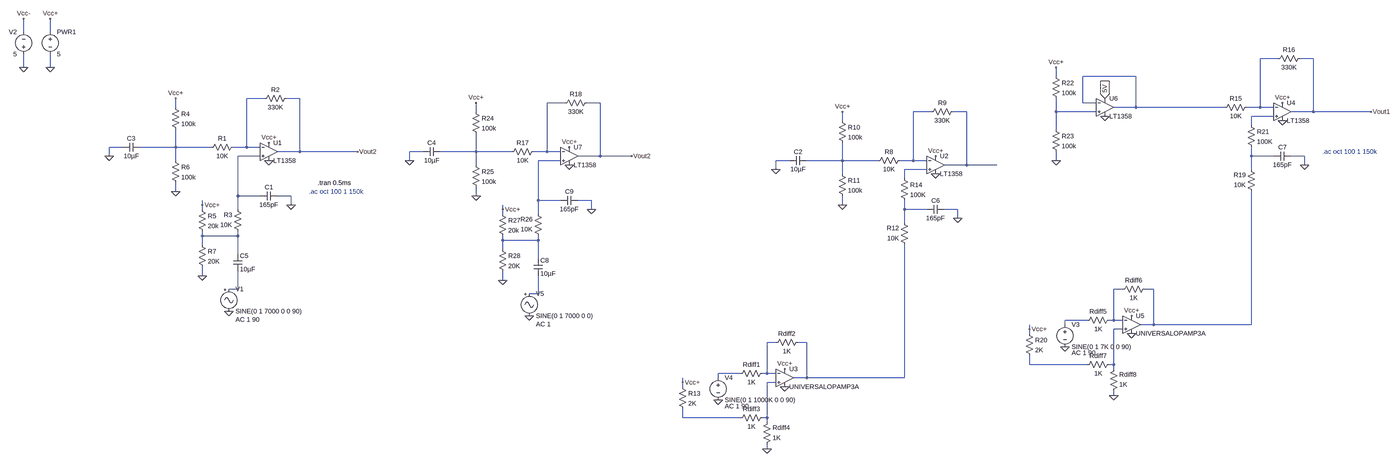
[diagram p0: schematic karens_new_amplifer_corrent_filtering_TESTTESTETESTSETE.asc, whole sheet]
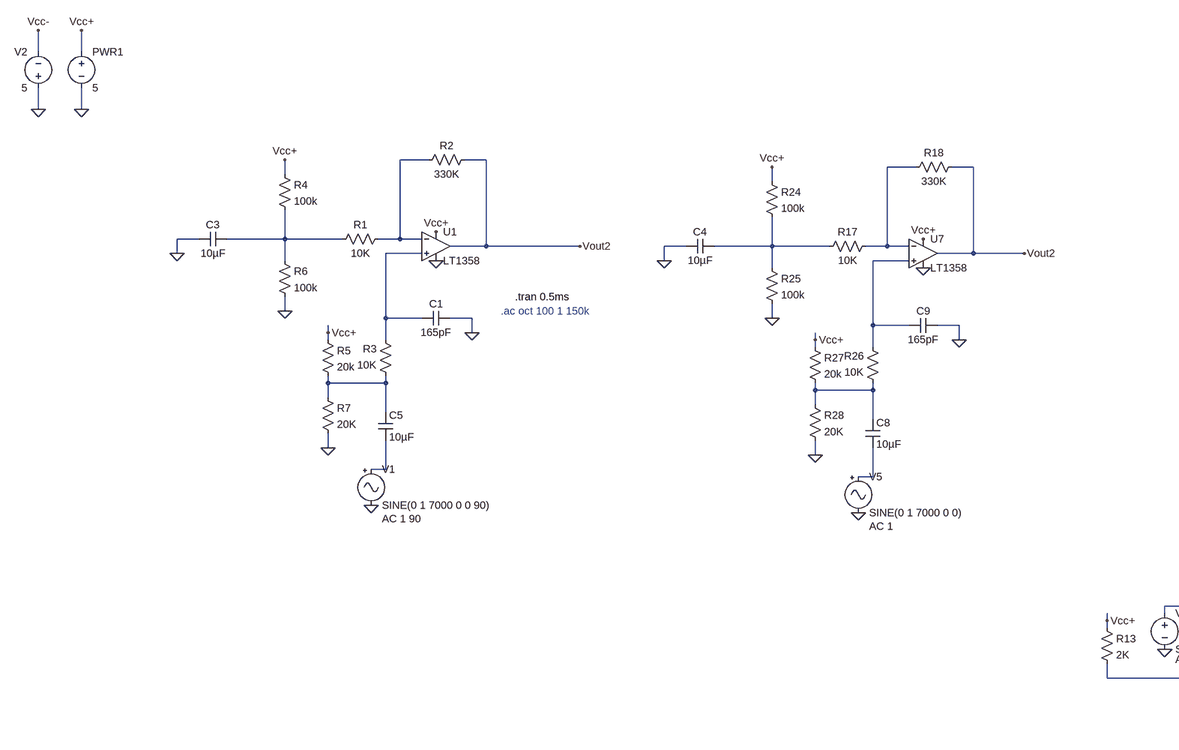
[diagram p1: schematic karens_new_amplifer_corrent_filtering_TESTTESTETESTSETE.asc, part, row 1 of 1, column 1 of 2]
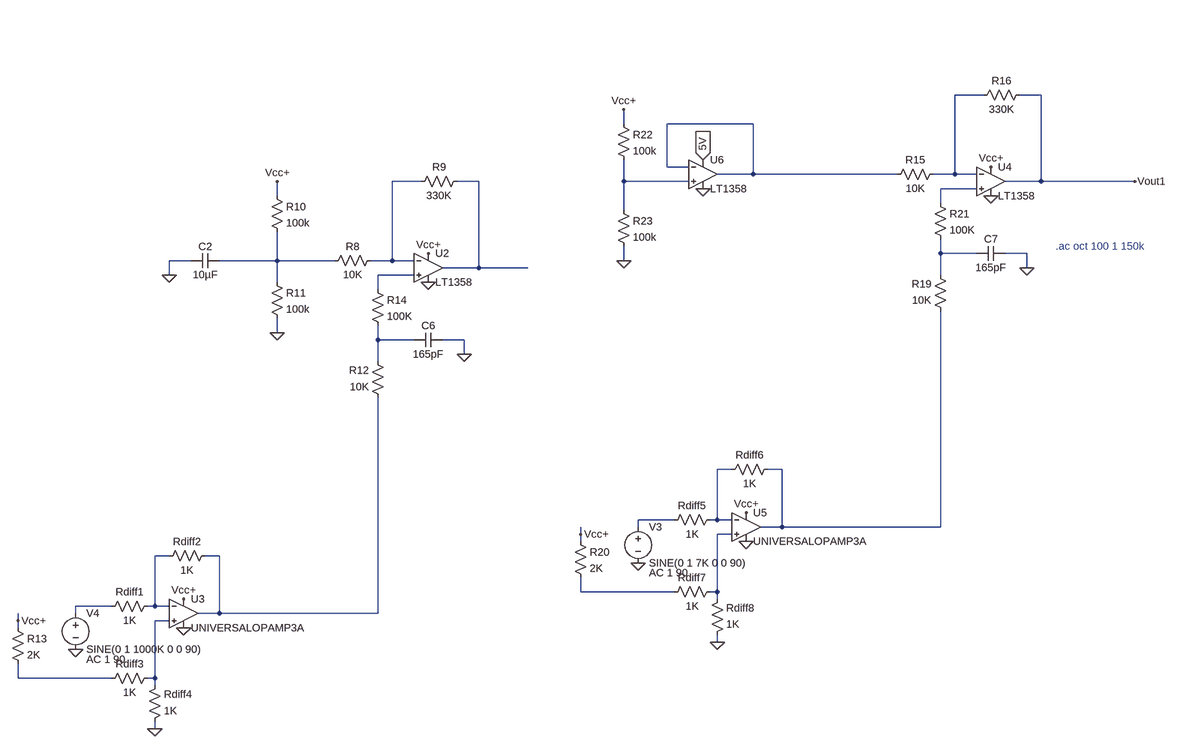
[diagram p2: schematic karens_new_amplifer_corrent_filtering_TESTTESTETESTSETE.asc, part, row 1 of 1, column 2 of 2]
karens_new_amplifer_corrent_filtering_TESTTESTETESTSETE.asc, the LTspice schematic file:
Version 4
SHEET 1 7728 1648
WIRE 32 -112 32 -160
WIRE 128 -112 128 -160
WIRE 7312 -16 7248 -16
WIRE 7440 -16 7392 -16
WIRE 32 16 32 -32
WIRE 128 16 128 -32
WIRE 6512 48 6512 16
WIRE 6800 48 6608 48
WIRE 1712 128 1648 128
WIRE 1840 128 1792 128
WIRE 2912 144 2848 144
WIRE 3040 144 2992 144
WIRE 6608 144 6608 48
WIRE 6656 144 6608 144
WIRE 1392 160 1392 128
WIRE 6800 160 6800 48
WIRE 6800 160 6720 160
WIRE 7120 160 6800 160
WIRE 7248 160 7248 -16
WIRE 7248 160 7200 160
WIRE 7296 160 7248 160
WIRE 2592 176 2592 144
WIRE 5088 176 5024 176
WIRE 5216 176 5168 176
WIRE 6512 176 6512 128
WIRE 6656 176 6512 176
WIRE 7440 176 7440 -16
WIRE 7440 176 7360 176
WIRE 7648 176 7440 176
WIRE 7296 192 7216 192
WIRE 4768 208 4768 176
WIRE 7216 224 7216 192
WIRE 6512 240 6512 176
WIRE 1200 304 1152 304
WIRE 1392 304 1392 240
WIRE 1392 304 1264 304
WIRE 1520 304 1392 304
WIRE 1648 304 1648 128
WIRE 1648 304 1600 304
WIRE 1696 304 1648 304
WIRE 1840 320 1840 128
WIRE 1840 320 1760 320
WIRE 2048 320 1840 320
WIRE 2400 320 2352 320
WIRE 2592 320 2592 256
WIRE 2592 320 2464 320
WIRE 2720 320 2592 320
WIRE 2848 320 2848 144
WIRE 2848 320 2800 320
WIRE 2896 320 2848 320
WIRE 1152 336 1152 304
WIRE 1696 336 1616 336
WIRE 3040 336 3040 144
WIRE 3040 336 2960 336
WIRE 3248 336 3040 336
WIRE 7216 336 7216 304
WIRE 7296 336 7216 336
WIRE 7408 336 7360 336
WIRE 1392 352 1392 304
WIRE 2352 352 2352 320
WIRE 2896 352 2816 352
WIRE 4576 352 4528 352
WIRE 4768 352 4768 288
WIRE 4768 352 4640 352
WIRE 4896 352 4768 352
WIRE 5024 352 5024 176
WIRE 5024 352 4976 352
WIRE 5072 352 5024 352
WIRE 6512 352 6512 320
WIRE 2592 368 2592 320
WIRE 5216 368 5216 176
WIRE 5216 368 5136 368
WIRE 5424 368 5216 368
WIRE 7408 368 7408 336
WIRE 4528 384 4528 352
WIRE 5072 384 4992 384
WIRE 7216 384 7216 336
WIRE 4768 400 4768 352
WIRE 4992 416 4992 384
WIRE 1392 464 1392 432
WIRE 1616 480 1616 336
WIRE 1696 480 1616 480
WIRE 1808 480 1760 480
WIRE 2592 480 2592 448
WIRE 2816 496 2816 352
WIRE 2896 496 2816 496
WIRE 3008 496 2960 496
WIRE 1488 512 1488 496
WIRE 1808 512 1808 480
WIRE 4768 512 4768 480
WIRE 1488 528 1488 512
WIRE 1616 528 1616 480
WIRE 2688 528 2688 512
WIRE 3008 528 3008 496
WIRE 4992 528 4992 496
WIRE 5072 528 4992 528
WIRE 5184 528 5136 528
WIRE 2688 544 2688 528
WIRE 2816 544 2816 496
WIRE 5184 560 5184 528
WIRE 4992 576 4992 528
WIRE 1488 624 1488 608
WIRE 1616 624 1616 608
WIRE 1616 624 1488 624
WIRE 2688 640 2688 624
WIRE 2816 640 2816 624
WIRE 2816 640 2688 640
WIRE 1488 656 1488 624
WIRE 2688 672 2688 640
WIRE 1616 688 1616 624
WIRE 2816 704 2816 640
WIRE 1488 768 1488 736
WIRE 2688 784 2688 752
WIRE 1616 816 1616 752
WIRE 1616 816 1584 816
WIRE 6752 816 6720 816
WIRE 6864 816 6832 816
WIRE 2816 832 2816 768
WIRE 2816 832 2784 832
WIRE 6624 928 6544 928
WIRE 6720 928 6720 816
WIRE 6720 928 6704 928
WIRE 6752 928 6720 928
WIRE 6544 944 6544 928
WIRE 6864 944 6864 816
WIRE 6864 944 6816 944
WIRE 7216 944 7216 464
WIRE 7216 944 6864 944
WIRE 6416 960 6416 944
WIRE 6752 960 6720 960
WIRE 6416 976 6416 960
WIRE 4528 1008 4496 1008
WIRE 4640 1008 4608 1008
WIRE 6416 1088 6416 1056
WIRE 6624 1088 6416 1088
WIRE 6720 1088 6720 960
WIRE 6720 1088 6704 1088
WIRE 6720 1104 6720 1088
WIRE 4400 1120 4320 1120
WIRE 4496 1120 4496 1008
WIRE 4496 1120 4480 1120
WIRE 4528 1120 4496 1120
WIRE 4320 1136 4320 1120
WIRE 4640 1136 4640 1008
WIRE 4640 1136 4592 1136
WIRE 4992 1136 4992 656
WIRE 4992 1136 4640 1136
WIRE 4192 1152 4192 1136
WIRE 4528 1152 4496 1152
WIRE 4192 1168 4192 1152
WIRE 6720 1200 6720 1184
WIRE 4192 1280 4192 1248
WIRE 4400 1280 4192 1280
WIRE 4496 1280 4496 1152
WIRE 4496 1280 4480 1280
WIRE 4496 1296 4496 1280
WIRE 4496 1392 4496 1376
FLAG 1728 288 Vcc+
FLAG 1728 352 0
FLAG 2048 320 Vout2
FLAG 1392 128 Vcc+
FLAG 1392 464 0
FLAG 1152 336 0
FLAG 1488 768 0
FLAG 1488 512 Vcc+
FLAG 1808 512 0
FLAG 1584 896 0
FLAG 128 -160 Vcc+
FLAG 128 16 0
FLAG 32 16 0
FLAG 32 -160 Vcc-
FLAG 5104 336 Vcc+
FLAG 5104 400 0
FLAG 4768 176 Vcc+
FLAG 4768 512 0
FLAG 4528 384 0
FLAG 4192 1152 Vcc+
FLAG 5184 560 0
FLAG 4560 1104 Vcc+
FLAG 4560 1168 0
FLAG 4320 1216 0
FLAG 4496 1392 0
FLAG 7328 144 Vcc+
FLAG 7328 208 0
FLAG 7648 176 Vout1
FLAG 6416 960 Vcc+
FLAG 7408 368 0
FLAG 6784 912 Vcc+
FLAG 6784 976 0
FLAG 6544 1024 0
FLAG 6720 1200 0
FLAG 6512 16 Vcc+
FLAG 6512 352 0
FLAG 6688 128 5V
IOPIN 6688 128 In
FLAG 6688 192 0
FLAG 2928 304 Vcc+
FLAG 2928 368 0
FLAG 3248 336 Vout2
FLAG 2592 144 Vcc+
FLAG 2592 480 0
FLAG 2352 352 0
FLAG 2688 784 0
FLAG 2688 528 Vcc+
FLAG 3008 528 0
FLAG 2784 912 0
SYMBOL Res 1616 288 R90
WINDOW 0 0 56 VBottom 2
WINDOW 3 32 56 VTop 2
SYMATTR InstName R1
SYMATTR Value 10K
SYMBOL OpAmps/LT1358 1728 256 R0
SYMATTR InstName U1
SYMBOL Res 1808 112 R90
WINDOW 0 0 56 VBottom 2
WINDOW 3 32 56 VTop 2
SYMATTR InstName R2
SYMATTR Value 330K
SYMBOL Res 1376 144 R0
SYMATTR InstName R4
SYMATTR Value 100k
SYMBOL Res 1376 336 R0
SYMATTR InstName R6
SYMATTR Value 100k
SYMBOL Cap 1264 288 R90
WINDOW 0 0 32 VBottom 2
WINDOW 3 32 32 VTop 2
SYMATTR InstName C3
SYMATTR Value 10µF
SYMBOL Res 1632 624 R180
WINDOW 0 36 76 Left 2
WINDOW 3 36 40 Left 2
SYMATTR InstName R3
SYMATTR Value 10K
SYMBOL Cap 1600 688 R0
SYMATTR InstName C5
SYMATTR Value 10µF
SYMBOL Res 1472 512 R0
SYMATTR InstName R5
SYMATTR Value 20k
SYMBOL Res 1472 640 R0
SYMATTR InstName R7
SYMATTR Value 20K
SYMBOL Cap 1760 464 R90
WINDOW 0 0 32 VBottom 2
WINDOW 3 32 32 VTop 2
SYMATTR InstName C1
SYMATTR Value 165pF
SYMBOL Voltage 128 -128 R0
SYMATTR InstName PWR1
SYMATTR Value 5
SYMBOL Voltage 32 -16 R180
WINDOW 0 24 96 Left 2
WINDOW 3 24 16 Left 2
SYMATTR InstName V2
SYMATTR Value 5
SYMBOL Misc/signal 1584 800 R0
WINDOW 123 24 126 Left 2
SYMATTR Value2 AC 1 90
SYMATTR InstName V1
SYMATTR Value SINE(0 1 7000 0 0 90)
SYMBOL Res 4992 336 R90
WINDOW 0 0 56 VBottom 2
WINDOW 3 32 56 VTop 2
SYMATTR InstName R8
SYMATTR Value 10K
SYMBOL OpAmps/LT1358 5104 304 R0
SYMATTR InstName U2
SYMBOL Res 5184 160 R90
WINDOW 0 0 56 VBottom 2
WINDOW 3 32 56 VTop 2
SYMATTR InstName R9
SYMATTR Value 330K
SYMBOL Res 4752 192 R0
SYMATTR InstName R10
SYMATTR Value 100k
SYMBOL Res 4752 384 R0
SYMATTR InstName R11
SYMATTR Value 100k
SYMBOL Cap 4640 336 R90
WINDOW 0 0 32 VBottom 2
WINDOW 3 32 32 VTop 2
SYMATTR InstName C2
SYMATTR Value 10µF
SYMBOL Res 5008 672 R180
WINDOW 0 36 76 Left 2
WINDOW 3 36 40 Left 2
SYMATTR InstName R12
SYMATTR Value 10K
SYMBOL Res 4176 1152 R0
SYMATTR InstName R13
SYMATTR Value 2K
SYMBOL Cap 5136 512 R90
WINDOW 0 0 32 VBottom 2
WINDOW 3 32 32 VTop 2
SYMATTR InstName C6
SYMATTR Value 165pF
SYMBOL Voltage 4320 1120 R0
WINDOW 123 24 118 Left 2
SYMATTR Value2 AC 1 90
SYMATTR InstName V4
SYMATTR Value SINE(0 1 1000K 0 0 90)
SYMBOL Res 4496 1104 R90
WINDOW 0 0 56 VBottom 2
WINDOW 3 32 56 VTop 2
SYMATTR InstName Rdiff1
SYMATTR Value 1K
SYMBOL Res 4624 992 R90
WINDOW 0 0 56 VBottom 2
WINDOW 3 32 56 VTop 2
SYMATTR InstName Rdiff2
SYMATTR Value 1K
SYMBOL OpAmps/UniversalOpAmp3a 4560 1136 R0
SYMATTR InstName U3
SYMBOL Res 4496 1264 R90
WINDOW 0 0 56 VBottom 2
WINDOW 3 32 56 VTop 2
SYMATTR InstName Rdiff3
SYMATTR Value 1K
SYMBOL Res 4480 1392 M180
WINDOW 0 36 76 Left 2
WINDOW 3 36 40 Left 2
SYMATTR InstName Rdiff4
SYMATTR Value 1K
SYMBOL Res 4976 400 R0
SYMATTR InstName R14
SYMATTR Value 100K
SYMBOL Res 7216 144 R90
WINDOW 0 0 56 VBottom 2
WINDOW 3 32 56 VTop 2
SYMATTR InstName R15
SYMATTR Value 10K
SYMBOL OpAmps/LT1358 7328 112 R0
SYMATTR InstName U4
SYMBOL Res 7408 -32 R90
WINDOW 0 0 56 VBottom 2
WINDOW 3 32 56 VTop 2
SYMATTR InstName R16
SYMATTR Value 330K
SYMBOL Res 7232 480 R180
WINDOW 0 36 76 Left 2
WINDOW 3 36 40 Left 2
SYMATTR InstName R19
SYMATTR Value 10K
SYMBOL Res 6400 960 R0
SYMATTR InstName R20
SYMATTR Value 2K
SYMBOL Cap 7360 320 R90
WINDOW 0 0 32 VBottom 2
WINDOW 3 32 32 VTop 2
SYMATTR InstName C7
SYMATTR Value 165pF
SYMBOL Voltage 6544 928 R0
WINDOW 123 24 118 Left 2
SYMATTR Value2 AC 1 90
SYMATTR InstName V3
SYMATTR Value SINE(0 1 7K 0 0 90)
SYMBOL Res 6720 912 R90
WINDOW 0 0 56 VBottom 2
WINDOW 3 32 56 VTop 2
SYMATTR InstName Rdiff5
SYMATTR Value 1K
SYMBOL Res 6848 800 R90
WINDOW 0 0 56 VBottom 2
WINDOW 3 32 56 VTop 2
SYMATTR InstName Rdiff6
SYMATTR Value 1K
SYMBOL OpAmps/UniversalOpAmp3a 6784 944 R0
SYMATTR InstName U5
SYMBOL Res 6720 1072 R90
WINDOW 0 0 56 VBottom 2
WINDOW 3 32 56 VTop 2
SYMATTR InstName Rdiff7
SYMATTR Value 1K
SYMBOL Res 6704 1200 M180
WINDOW 0 36 76 Left 2
WINDOW 3 36 40 Left 2
SYMATTR InstName Rdiff8
SYMATTR Value 1K
SYMBOL Res 7200 208 R0
SYMATTR InstName R21
SYMATTR Value 100K
SYMBOL Res 6496 32 R0
SYMATTR InstName R22
SYMATTR Value 100k
SYMBOL Res 6496 224 R0
SYMATTR InstName R23
SYMATTR Value 100k
SYMBOL OpAmps/LT1358 6688 96 R0
SYMATTR InstName U6
SYMBOL Res 2816 304 R90
WINDOW 0 0 56 VBottom 2
WINDOW 3 32 56 VTop 2
SYMATTR InstName R17
SYMATTR Value 10K
SYMBOL OpAmps/LT1358 2928 272 R0
SYMATTR InstName U7
SYMBOL Res 3008 128 R90
WINDOW 0 0 56 VBottom 2
WINDOW 3 32 56 VTop 2
SYMATTR InstName R18
SYMATTR Value 330K
SYMBOL Res 2576 160 R0
SYMATTR InstName R24
SYMATTR Value 100k
SYMBOL Res 2576 352 R0
SYMATTR InstName R25
SYMATTR Value 100k
SYMBOL Cap 2464 304 R90
WINDOW 0 0 32 VBottom 2
WINDOW 3 32 32 VTop 2
SYMATTR InstName C4
SYMATTR Value 10µF
SYMBOL Res 2832 640 R180
WINDOW 0 36 76 Left 2
WINDOW 3 36 40 Left 2
SYMATTR InstName R26
SYMATTR Value 10K
SYMBOL Cap 2800 704 R0
SYMATTR InstName C8
SYMATTR Value 10µF
SYMBOL Res 2672 528 R0
SYMATTR InstName R27
SYMATTR Value 20k
SYMBOL Res 2672 656 R0
SYMATTR InstName R28
SYMATTR Value 20K
SYMBOL Cap 2960 480 R90
WINDOW 0 0 32 VBottom 2
WINDOW 3 32 32 VTop 2
SYMATTR InstName C9
SYMATTR Value 165pF
SYMBOL Misc/signal 2784 816 R0
WINDOW 123 24 126 Left 2
SYMATTR Value2 AC 1
SYMATTR InstName V5
SYMATTR Value SINE(0 1 7000 0 0)
TEXT 1904 432 Left 2 !.tran 0.5ms
TEXT 1872 464 Left 2 ;.ac oct 100 1 150k
TEXT 7472 320 Left 2 ;.ac oct 100 1 150k

The netlist it stands for:
* karens_new_amplifer_corrent_filtering_TESTTESTETESTSETE.asc
R1 N003 N009 10K
XU1 N011 N003 Vcc+ 0 Vout2 LT1357  ; LT1358, pins In+ In- V+ V- OUT
R2 Vout2 N003 330K
R4 Vcc+ N009 100k
R6 N009 0 100k
C3 N009 0 10µF
R3 N017 N011 10K
C5 N017 N019 10µF
R5 Vcc+ N017 20k
R7 N017 0 20K
C1 0 N011 165pF
V§PWR1 Vcc+ 0 5
V2 0 Vcc- 5
V1 N019 0 SINE(0 1 7000 0 0 90) AC 1 90
R8 N005 N014 10K
XU2 N015 N005 Vcc+ 0 N006 LT1357  ; LT1358, pins In+ In- V+ V- OUT
R9 N006 N005 330K
R10 Vcc+ N014 100k
R11 N014 0 100k
C2 N014 0 10µF
R12 N026 N016 10K
R13 Vcc+ N030 2K
C6 0 N016 165pF
V4 N028 0 SINE(0 1 1000K 0 0 90) AC 1 90
Rdiff1 N025 N028 1K
Rdiff2 N026 N025 1K
XU3 N029 N025 Vcc+ 0 N026 level3a Avol=1Meg GBW=10Meg Slew=10Meg Ilimit=25m Rail=0 Vos=0 Phimargin=45 En=0 Enk=0 In=0 Ink=0 Rin=500Meg  ; UNIVERSALOPAMP3A, pins In+ In- V+ V- OUT
Rdiff3 N029 N030 1K
Rdiff4 0 N029 1K
R14 N015 N016 100K
R15 N001 N002 10K
XU4 N008 N001 Vcc+ 0 Vout1 LT1357  ; LT1358, pins In+ In- V+ V- OUT
R16 Vout1 N001 330K
R19 N021 N012 10K
R20 Vcc+ N027 2K
C7 0 N012 165pF
V3 N023 0 SINE(0 1 7K 0 0 90) AC 1 90
Rdiff5 N020 N023 1K
Rdiff6 N021 N020 1K
XU5 N024 N020 Vcc+ 0 N021 level3a Avol=1Meg GBW=10Meg Slew=10Meg Ilimit=25m Rail=0 Vos=0 Phimargin=45 En=0 Enk=0 In=0 Ink=0 Rin=500Meg  ; UNIVERSALOPAMP3A, pins In+ In- V+ V- OUT
Rdiff7 N024 N027 1K
Rdiff8 0 N024 1K
R21 N008 N012 100K
R22 Vcc+ N007 100k
R23 N007 0 100k
XU6 N007 N002 5V 0 N002 LT1357  ; LT1358, pins In+ In- V+ V- OUT
R17 N004 N010 10K
XU7 N013 N004 Vcc+ 0 Vout2 LT1357  ; LT1358, pins In+ In- V+ V- OUT
R18 Vout2 N004 330K
R24 Vcc+ N010 100k
R25 N010 0 100k
C4 N010 0 10µF
R26 N018 N013 10K
C8 N018 N022 10µF
R27 Vcc+ N018 20k
R28 N018 0 20K
C9 0 N013 165pF
V5 N022 0 SINE(0 1 7000 0 0) AC 1
.tran 0.5ms
* .ac oct 100 1 150k
* .ac oct 100 1 150k
.lib LTC.lib
.backanno
.end